# Altium schematic sheet Sheet1.SchDoc
size A2 portrait; Organization: Altium Limited; Address1: L3, 12a Rodborough Rd; Address2: Frenchs Forest; Address3: NSW; Address4: Australia 2086
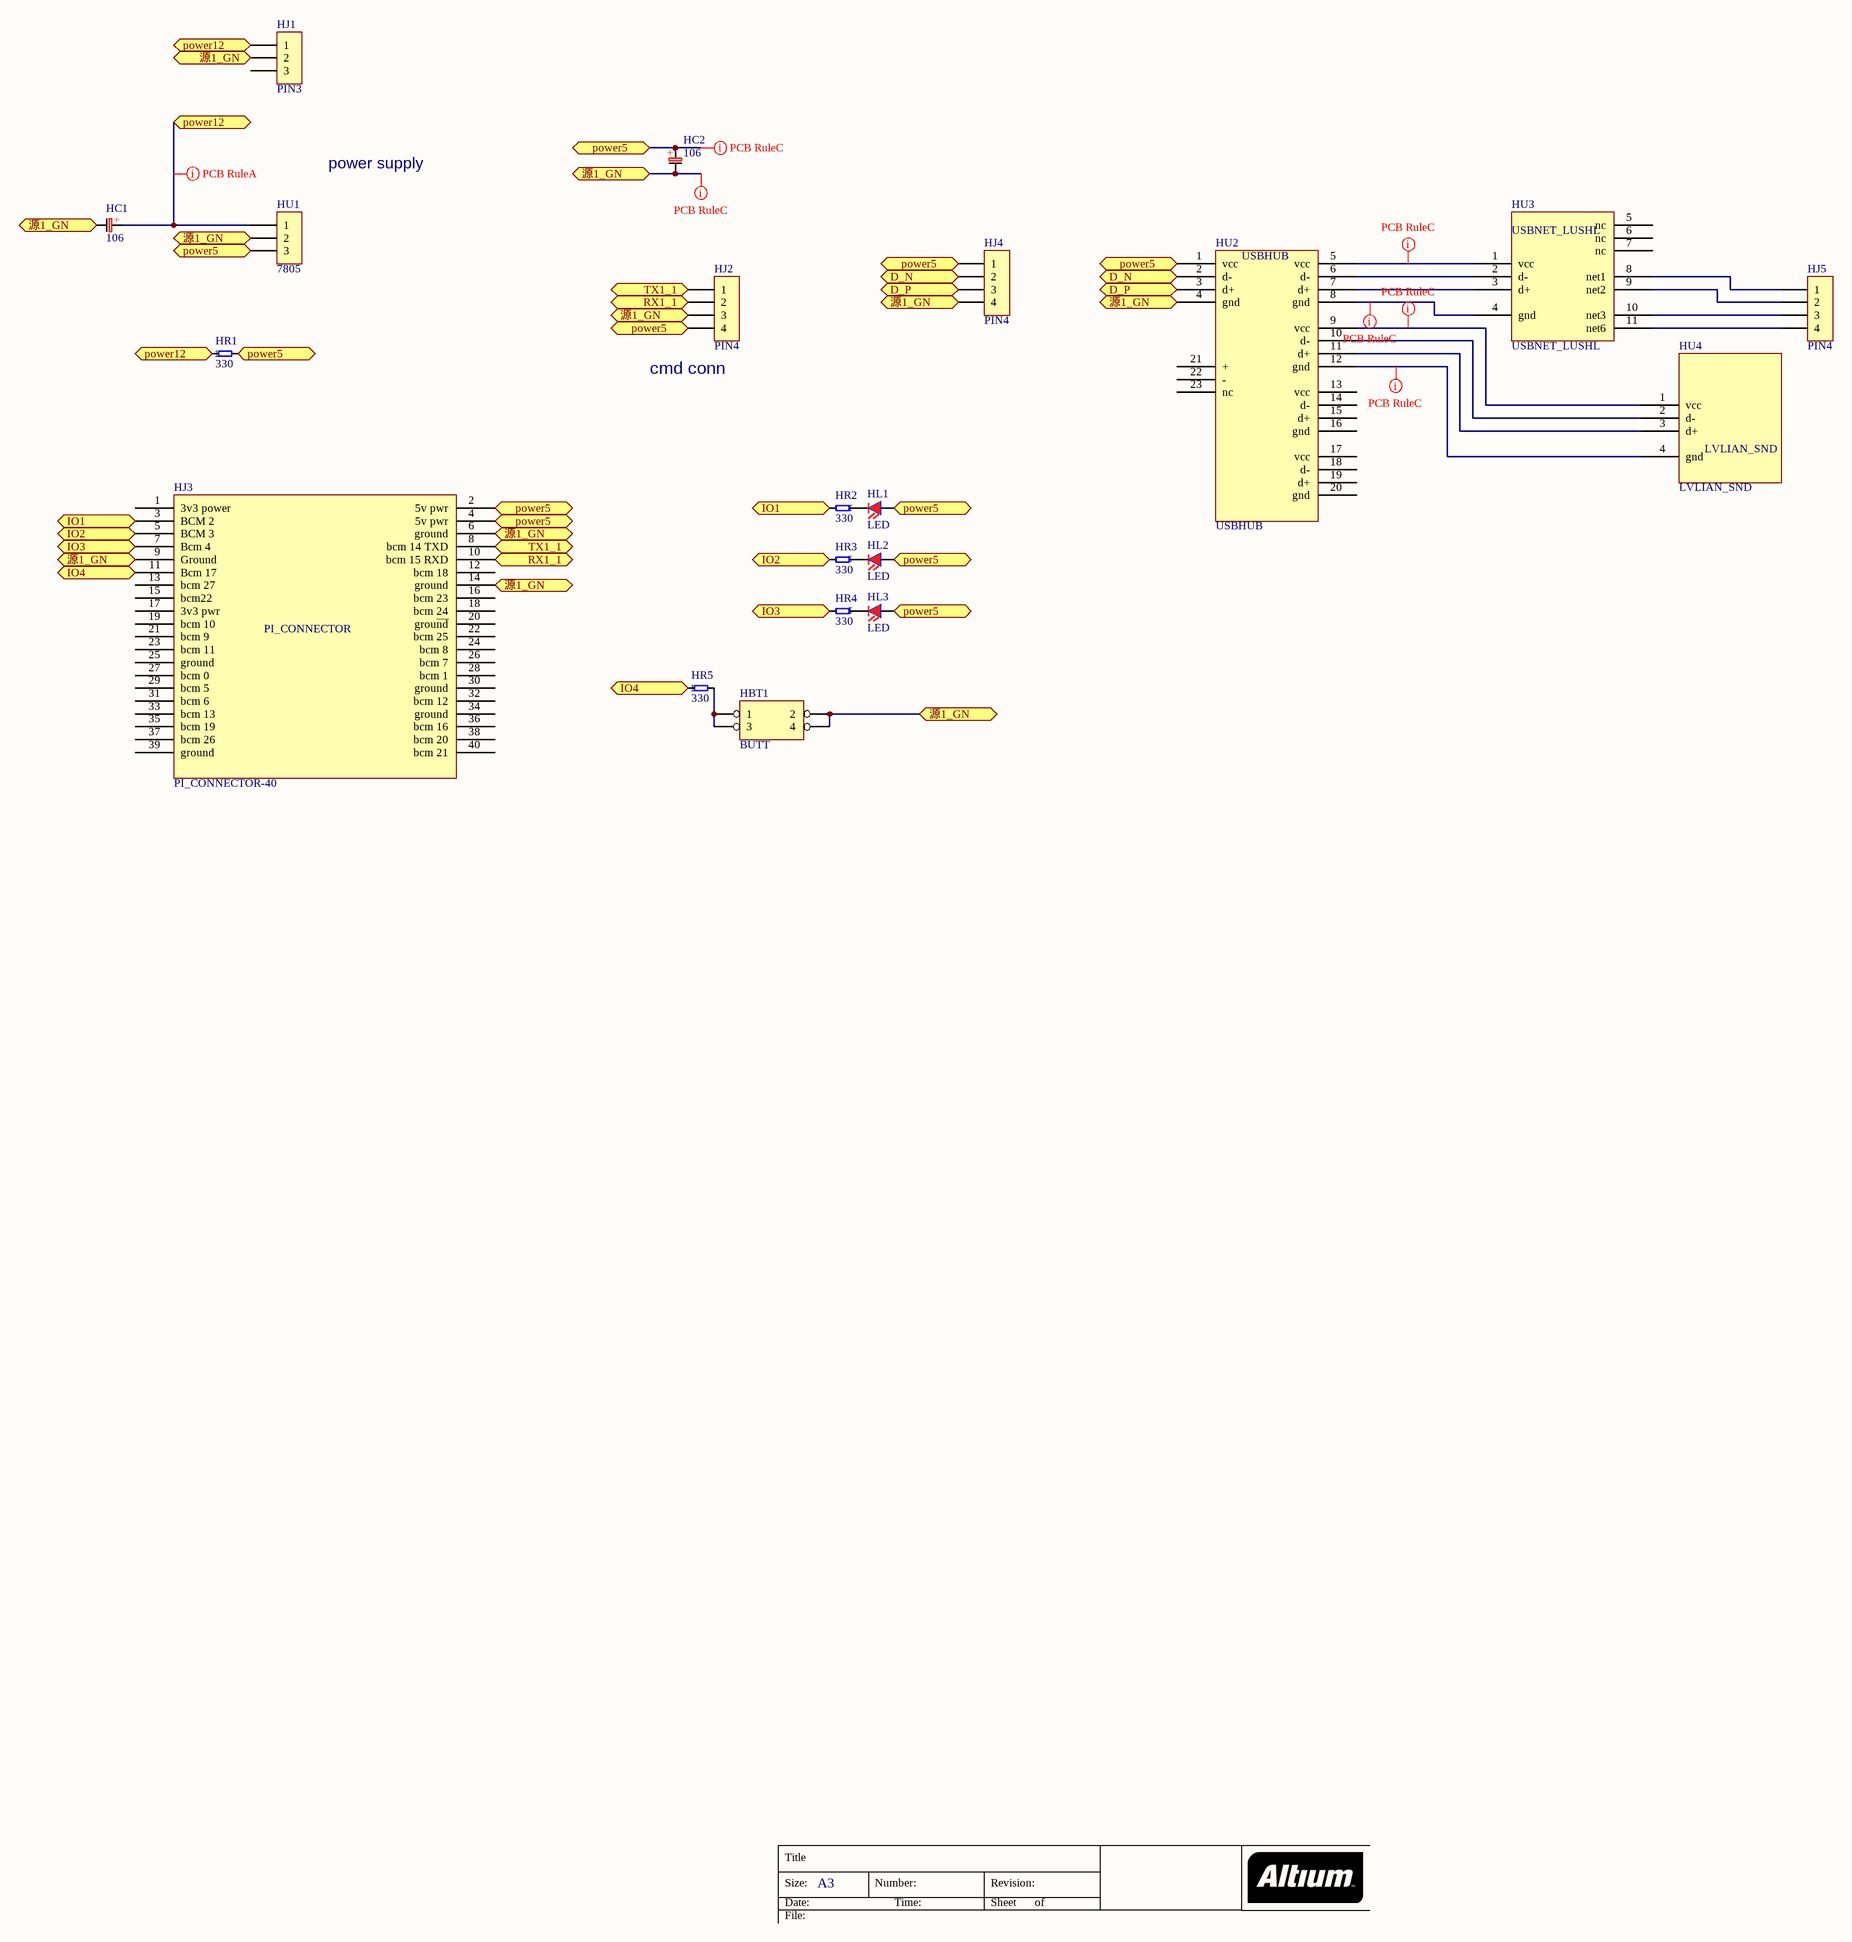
[diagram p0: Sheet1.SchDoc]

## Parts
HBT1  BUTT  [BUTT_01]
HC1  106  [LED0805]
HC2  106  [LED0805]
HJ1  PIN3  [JP3_1]
HJ2  PIN4  [JP4_1]
HJ3  PI_CONNECTOR-40  [PI_CONNECTOR]
HJ4  PIN4  [JP4_1]
HJ5  PIN4  [JP4_1]
HL1  LED  [LED0805]
HL2  LED  [LED0805]
HL3  LED  [LED0805]
HR1  330  [LED0805]
HR2  330  [LED0805]
HR3  330  [LED0805]
HR4  330  [LED0805]
HR5  330  [LED0805]
HU1  7805  [TO220_1]
HU2  USBHUB  [USBHUB]
HU3  USBNET_LUSHL  [USBNET_LUSHL]
HU4  LVLIAN_SND  [LVLIAN_SND]

## Ports
D_N, D_P, IO1, IO2, IO3, IO4, power5, power12, RX1_1, TX1_1, 源1_GN

## Nets
D_N: HJ4.2 HU2.2(d-) ; port D_N
D_P: HJ4.3 HU2.3(d+) ; port D_P
IO1: HJ3.3(BCM_2) HR2.2 ; port IO1
IO2: HJ3.5(BCM_3) HR3.2 ; port IO2
IO3: HJ3.7(Bcm_4) HR4.2 ; port IO3
IO4: HJ3.11(Bcm_17) HR5.1 ; port IO4
power5: HC2.1 HJ2.4 HJ3.2(5v_pwr) HJ3.4(5v_pwr) HJ4.1 HL1.A(a) HL2.A(a) HL3.A(a) HR1.2 HU1.3 HU2.1(vcc) ; port power5
power12: HC1.1 HJ1.1 HR1.1 HU1.1 ; port power12
RX1_1: HJ2.2 HJ3.10(bcm_15_RXD) ; port RX1_1
TX1_1: HJ2.1 HJ3.8(bcm_14_TXD) ; port TX1_1
源1_GN: HBT1.2 HBT1.4 HC1.2 HC2.2 HJ1.2 HJ2.3 HJ3.6(ground) HJ3.9(Ground) HJ3.14(ground) HJ4.4 HU1.2 HU2.4(gnd) ; port 源1_GN
NetHBT1_1: HBT1.1 HBT1.3 HR5.2
NetHJ5_1: HJ5.1 HU3.8(net1)
NetHJ5_2: HJ5.2 HU3.9(net2)
NetHJ5_3: HJ5.3 HU3.10(net3)
NetHJ5_4: HJ5.4 HU3.11(net6)
NetHL1_K: HL1.K(k) HR2.1
NetHL2_K: HL2.K(k) HR3.1
NetHL3_K: HL3.K(k) HR4.1
NetHU2_5: HU2.5(vcc) HU3.1(vcc)
NetHU2_6: HU2.6(d-) HU3.2(d-)
NetHU2_7: HU2.7(d+) HU3.3(d+)
NetHU2_8: HU2.8(gnd) HU3.4(gnd)
NetHU2_9: HU2.9(vcc) HU4.1(vcc)
NetHU2_10: HU2.10(d-) HU4.2(d-)
NetHU2_11: HU2.11(d+) HU4.3(d+)
NetHU2_12: HU2.12(gnd) HU4.4(gnd)

Not connected (* = marked no-connect by the designer): HJ1 3; HJ3 1(3v3_power) 12(bcm_18) 13(bcm_27) 15(bcm22) 16(bcm_23) 17(3v3_pwr) 18(bcm_24) 19(bcm_10) 20(grou~{nd}) 21(bcm_9) 22(bcm_25) 23(bcm_11) 24(bcm_8) 25(ground) 26(bcm_7) 27(bcm_0) 28(bcm_1) 29(bcm_5) 30(ground) 31(bcm_6) 32(bcm_12) 33(bcm_13) 34(ground) 35(bcm_19) 36(bcm_16) 37(bcm_26) 38(bcm_20) 39(ground) 40(bcm_21); HU2 13(vcc) 14(d-) 15(d+) 16(gnd) 17(vcc) 18(d-) 19(d+) 20(gnd) 21(+) 22(-) 23(nc); HU3 5(nc) 6(nc) 7(nc)

## Layout directives
rule Width Constraint [Pref Width = 22mil    Min Width = 16mil    Max Width = 22mil]: NetHU2_5, NetHU2_8, NetHU2_9, NetHU2_12, power5, 源1_GN
rule Width Constraint [Pref Width = 23mil    Min Width = 16mil    Max Width = 23mil]: power12

## Notes on the sheet
- power supply
- (near HJ2) cmd conn
- Title
- Size:
- Date:
- A3
- Number:
- Time:
- Revision:
- Sheet
- of
- File:
- A2
- (in symbol CD) +

## Library data of the parts
HBT1 = HEADER 
HC1 HC2 = CD
HJ1 HU1 = C: Connector
HJ2 HJ4 HJ5 = CON4: Connector
HJ3 = PI_CONNECTOR
HL1-HL3 = L: pin to pad: A>1 K>2
HR1-HR5 = R
HU2 = USBH: USB一转四
HU3 = USBNET_LUS: 铝壳USB转NET
HU4 = LVLIAN_: 绿联声卡